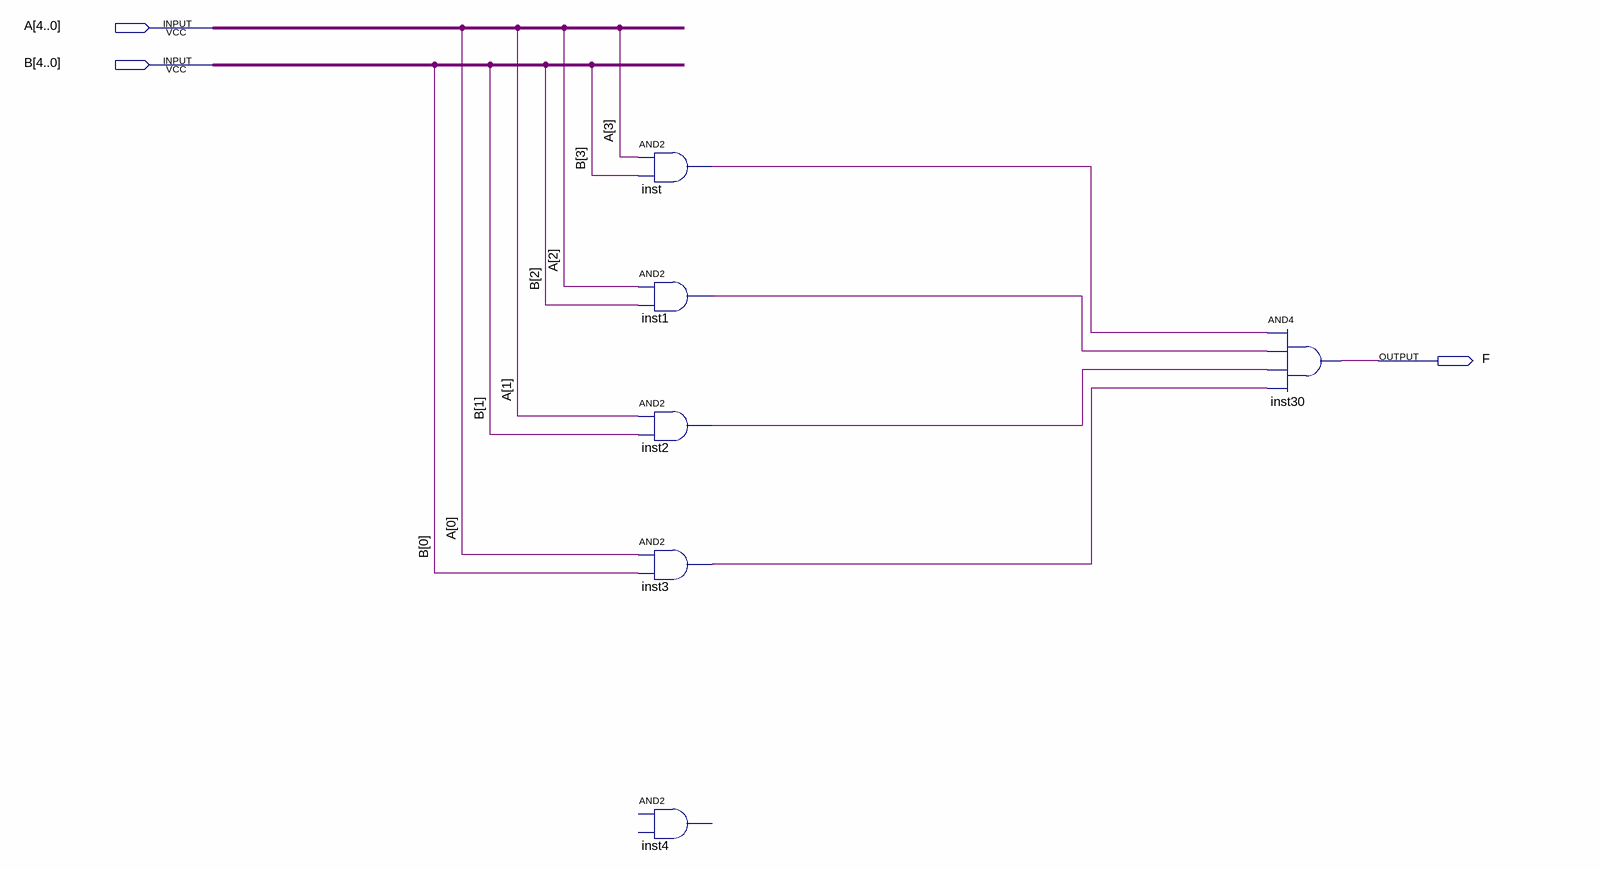
[diagram p0: schematic sheet]
// Quartus schematic modigual.bdf as structural Verilog: 6 symbols, 3 pins
module modigual (
  input  [4:0] A,
  input  [4:0] B,
  output F
);

  wire inst1_out, inst2_out, inst3_out, inst_out;

  and inst (inst_out, A[3], B[3]);
  and inst1 (inst1_out, A[2], B[2]);
  and inst2 (inst2_out, A[1], B[1]);
  and inst3 (inst3_out, A[0], B[0]);
  // AND2 inst4 is placed but not wired
  and inst30 (F, inst_out, inst1_out, inst2_out, inst3_out);
endmodule
